# Altium schematic sheet HFPB_01, PAGE-1.SchDoc: Power Board (part 1 of 2)
size 420 x 297 mm; Date: Monday, September 07, 2020; DocumentNumber: HFPB_01; Revision: .01; SheetNumber: 1; SheetTotal: 2; PageSetup: Record=PageOptions|CenterHorizontal=True|CenterVertical=True|PrintScale=0.71|XCorrection=1.00|YCorrection=1.00|PrintKind=0|BorderSize=5000000|LeftOffset=0|BottomOffset=0|Orientation=2|PaperLength=1000|PaperWidth=1000|Scale=100|PaperSource=7|PrintQuality=-3|MediaType=1|DitherType=10|PaperKind=A4|PrintScaleMode=1; PageName: Controller and Supply
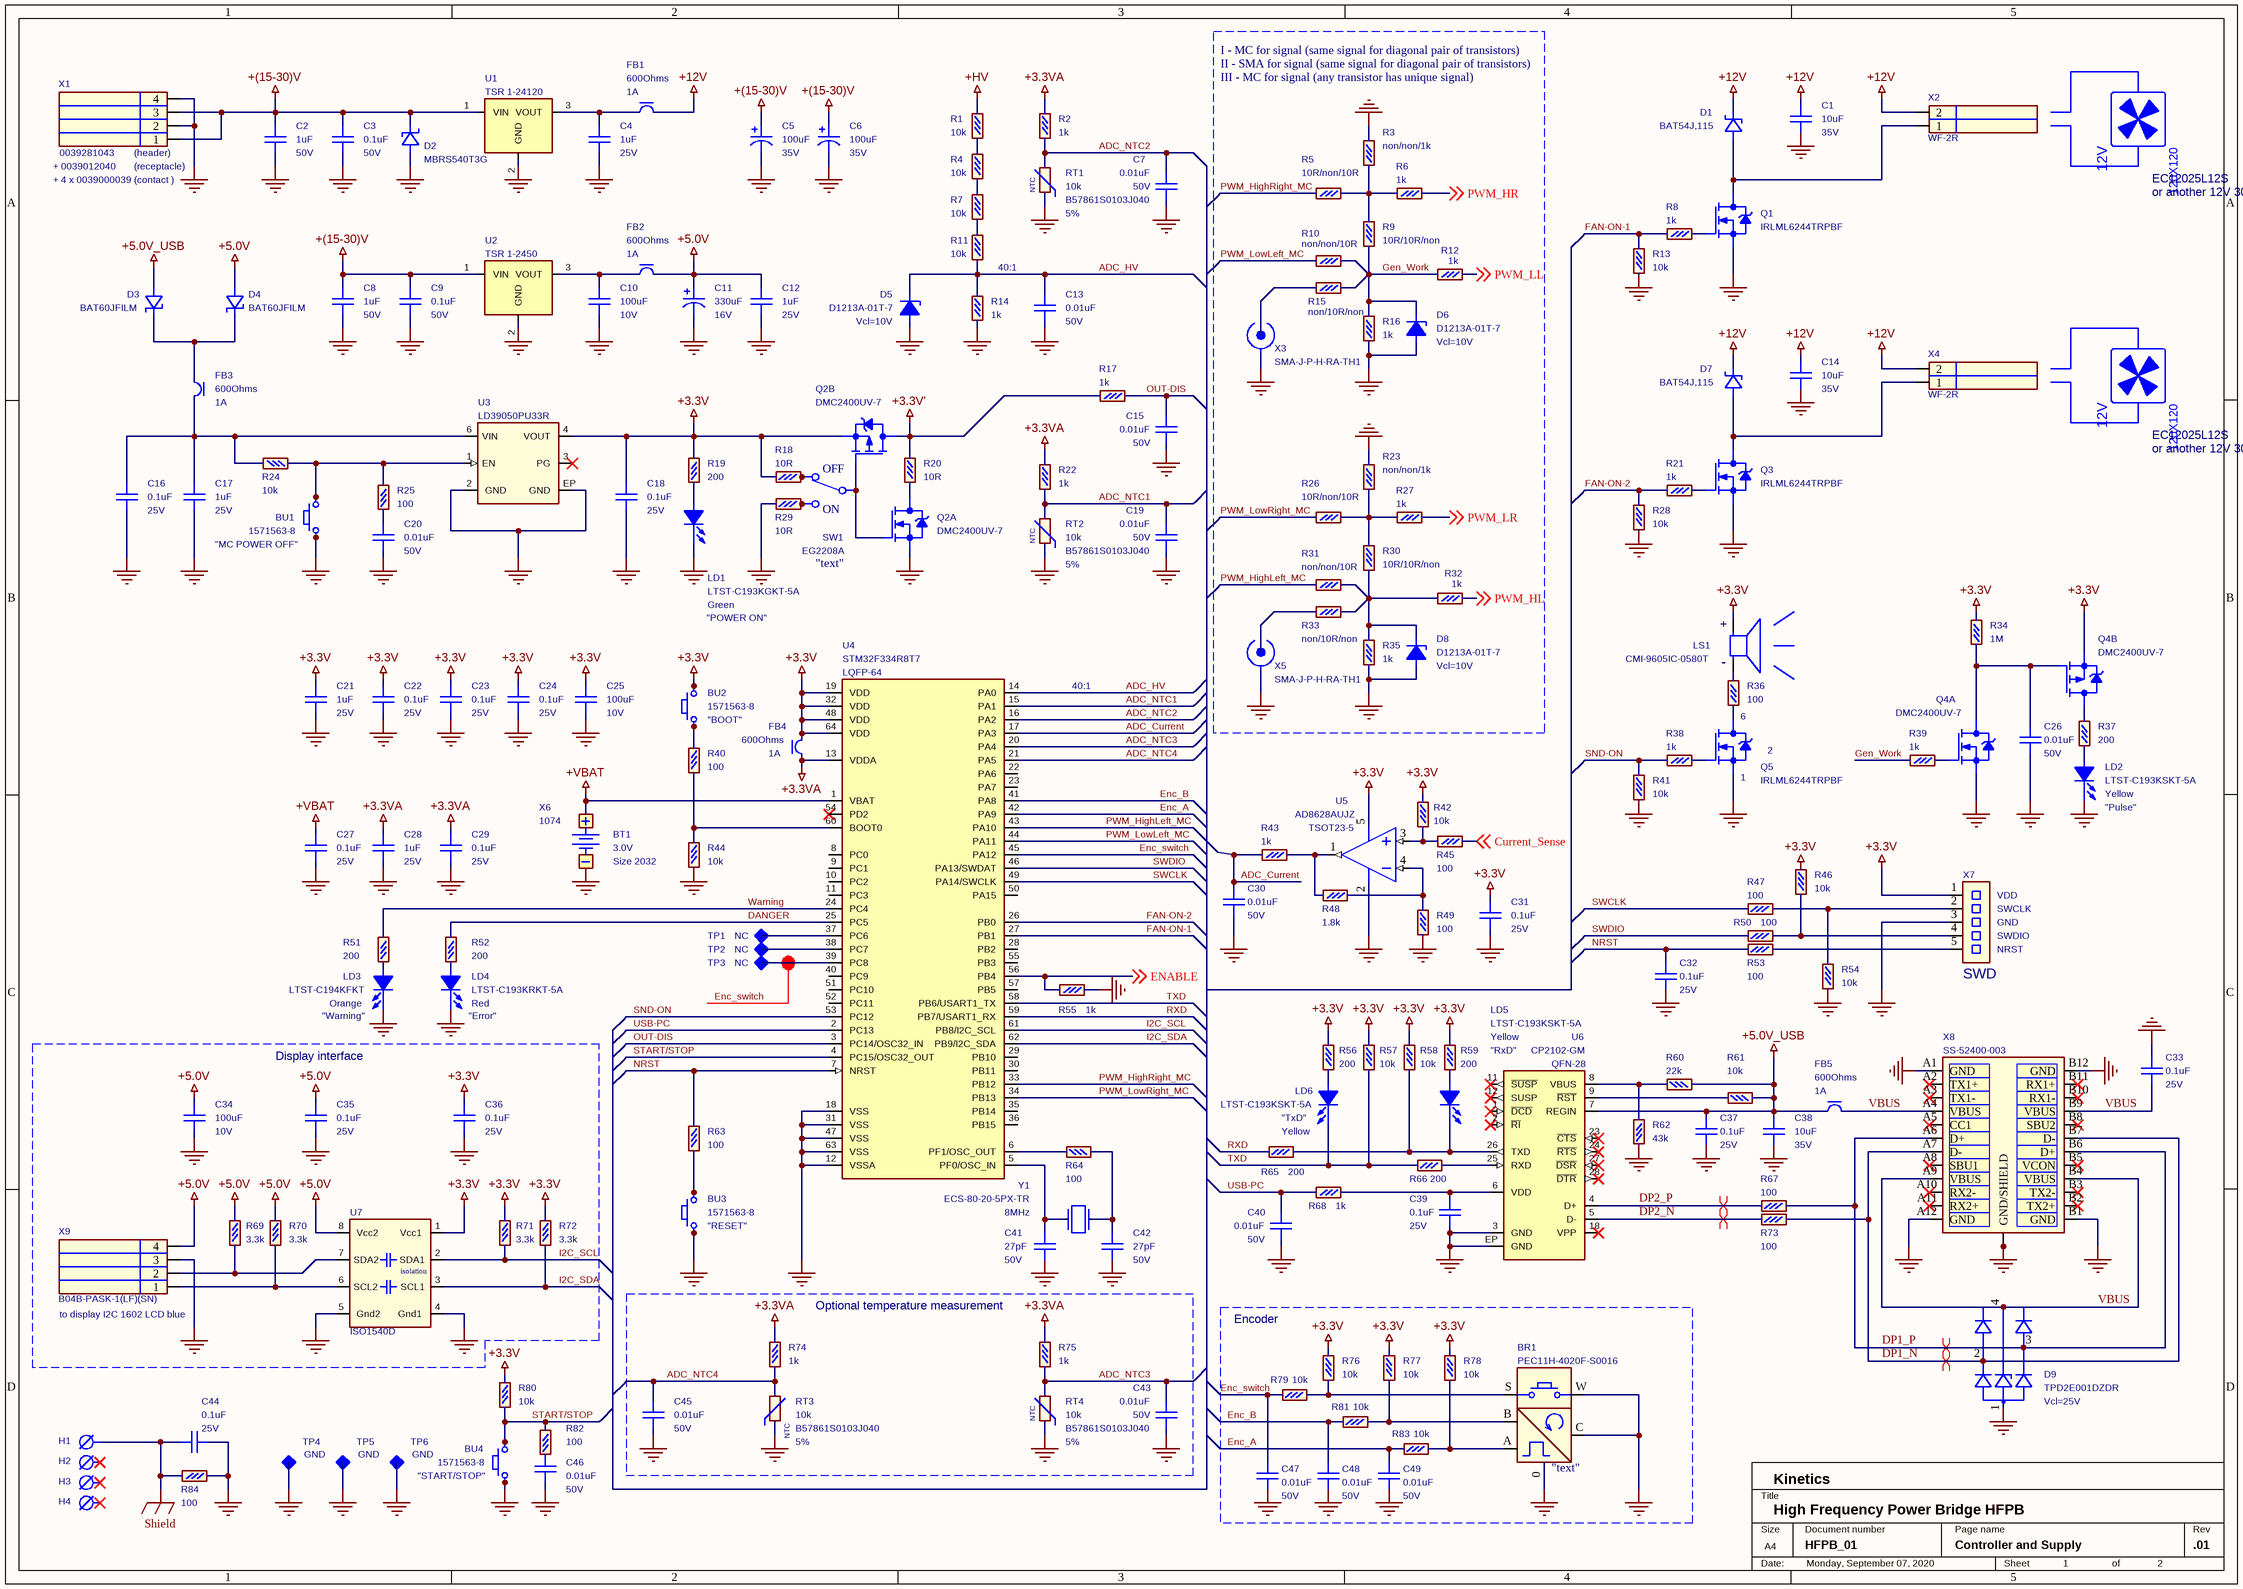
[diagram p0: HFPB_01, PAGE-1.SchDoc]

## Parts
BR1  PEC11H-4020F-S0016  value "text"  [BOURNS_PEC11H]
BT1  3.0V  (graphical)
BU1  1571563-8  value "MC POWER OFF"  [TE_1571563-8]
BU2  1571563-8  value "BOOT"  [TE_1571563-8]
BU3  1571563-8  value "RESET"  [TE_1571563-8]
BU4  1571563-8  value "START/STOP"  [TE_1571563-8]
C1  10uF  Value3: 35V  [CAPC320X250X280L60N - full legend]
C2  1uF  Value3: 50V  [CAPC160X80X80L35N - Full legend]
C3  0.1uF  Value3: 50V  [CAPC160X80X80L35N - Full legend]
C4  1uF  Value3: 25V  [CAPC160X80X80L35N - Full legend]
C5  100uF  Value3: 35V  [CAPPRD350W60D850H900]
C6  100uF  Value3: 35V  [CAPPRD350W60D850H900]
C7  0.01uF  Value3: 50V  [CAPC160X80X80L35N - Full legend]
C8  1uF  Value3: 50V  [CAPC160X80X80L35N - Full legend]
C9  0.1uF  Value3: 50V  [CAPC160X80X80L35N - Full legend]
C10  100uF  Value3: 10V  [CAPC320X250X280L60N - full legend]
C11  330uF  Value3: 16V  [CAPPRD350W60D850H900]
C12  1uF  Value3: 25V  [CAPC160X80X80L35N - Full legend]
C13  0.01uF  Value3: 50V  [CAPC160X80X80L35N - Full legend]
C14  10uF  Value3: 35V  [CAPC320X250X280L60N - full legend]
C15  0.01uF  Value3: 50V  [CAPC160X80X80L35N - Full legend]
C16  0.1uF  Value3: 25V  [CAPC160X80X80L35N - Full legend]
C17  1uF  Value3: 25V  [CAPC160X80X80L35N - Full legend]
C18  0.1uF  Value3: 25V  [CAPC160X80X80L35N - Full legend]
C19  0.01uF  Value3: 50V  [CAPC160X80X80L35N - Full legend]
C20  0.01uF  Value3: 50V  [CAPC160X80X80L35N - Full legend]
C21  1uF  Value3: 25V  [CAPC160X80X80L35N - Full legend]
C22  0.1uF  Value3: 25V  [CAPC160X80X80L35N - Full legend]
C23  0.1uF  Value3: 25V  [CAPC160X80X80L35N - Full legend]
C24  0.1uF  Value3: 25V  [CAPC160X80X80L35N - Full legend]
C25  100uF  Value3: 10V  [CAPC320X250X280L60N - full legend]
C26  0.01uF  Value3: 50V  [CAPC160X80X80L35N - Full legend]
C27  0.1uF  Value3: 25V  [CAPC160X80X80L35N - Full legend]
C28  1uF  Value3: 25V  [CAPC160X80X80L35N - Full legend]
C29  0.1uF  Value3: 25V  [CAPC160X80X80L35N - Full legend]
C30  0.01uF  Value3: 50V  [CAPC160X80X80L35N - Full legend]
C31  0.1uF  Value3: 25V  [CAPC160X80X80L35N - Full legend]
C32  0.1uF  Value3: 25V  [CAPC160X80X80L35N - Full legend]
C33  0.1uF  Value3: 25V  [CAPC160X80X80L35N - Full legend]
C34  100uF  Value3: 10V  [CAPC320X250X280L60N - full legend]
C35  0.1uF  Value3: 25V  [CAPC160X80X80L35N - Full legend]
C36  0.1uF  Value3: 25V  [CAPC160X80X80L35N - Full legend]
C37  0.1uF  Value3: 25V  [CAPC160X80X80L35N - Full legend]
C38  10uF  Value3: 35V  [CAPC320X250X280L60N - full legend]
C39  0.1uF  Value3: 25V  [CAPC160X80X80L35N - Full legend]
C40  0.01uF  Value3: 50V  [CAPC160X80X80L35N - Full legend]
C41  27pF  Value3: 50V  [CAPC160X80X80L35N - Full legend]
C42  27pF  Value3: 50V  [CAPC160X80X80L35N - Full legend]
C43  0.01uF  Value3: 50V  [CAPC160X80X80L35N - Full legend]
C44  0.1uF  Value3: 25V  [CAPC160X80X80L35N - Full legend]
C45  0.01uF  Value3: 50V  [CAPC160X80X80L35N - Full legend]
C46  0.01uF  Value3: 50V  [CAPC160X80X80L35N - Full legend]
C47  0.01uF  Value3: 50V  [CAPC160X80X80L35N - Full legend]
C48  0.01uF  Value3: 50V  [CAPC160X80X80L35N - Full legend]
C49  0.01uF  Value3: 50V  [CAPC160X80X80L35N - Full legend]
D1  BAT54J,115  [SODFL250X125X80L40X32N]
D2  MBRS540T3G  [DIOM795X585X240L100X300N]
D3  BAT60JFILM  [SOD250X125X110L30X32N]
D4  BAT60JFILM  [SOD250X125X110L30X32N]
D5  D1213A-01T-7  Value2: Vcl=10V  [SODFL160X80X65L30X30N]
D6  D1213A-01T-7  Value2: Vcl=10V  [SODFL160X80X65L30X30N]
D7  BAT54J,115  [SODFL250X125X80L40X32N]
D8  D1213A-01T-7  Value2: Vcl=10V  [SODFL160X80X65L30X30N]
D9  TPD2E001DZDR  Value2: Vcl=25V  [SOT143-4P192_237X122L40X40N]
FB1  600Ohms  Value1: 1A  [BEADC160X80X80L30N]
FB2  600Ohms  Value1: 1A  [BEADC160X80X80L30N]
FB3  600Ohms  Value1: 1A  [BEADC160X80X80L30N]
FB4  600Ohms  Value1: 1A  [BEADC160X80X80L30N]
FB5  600Ohms  Value1: 1A  [BEADC160X80X80L30N]
H1  (no value)  [hole/3.5/4.5-O]
H2  (no value)  [hole/3.5/4.5-O]
H3  (no value)  [hole/3.5/4.5-O]
H4  (no value)  [hole/3.5/4.5-O]
LD1  LTST-C193KGKT-5A  value Green  Text: "POWER ON"  [LEDC160X80X40L30N]
LD2  LTST-C193KSKT-5A  value Yellow  Text: "Pulse"  [LEDC160X80X40L30N]
LD3  LTST-C194KFKT  value Orange  Text: "Warning"  [LEDC160X80X40L30N]
LD4  LTST-C193KRKT-5A  value Red  Text: "Error"  [LEDC160X80X40L30N]
LD5  LTST-C193KSKT-5A  value Yellow  Text: "RxD"  [LEDC160X80X40L30N]
LD6  LTST-C193KSKT-5A  value Yellow  Text: "TxD"  [LEDC160X80X40L30N]
LS1  CMI-9605IC-0580T  [CUI_CMI-9605IC-0580T]
Q1  IRLML6244TRPBF  [SOT23-3P95_235X110L50X40N]
Q2  DMC2400UV-7  [TRXSOFL6P50_160X162X60L20X22N]  (parts A,B of 2)
Q3  IRLML6244TRPBF  [SOT23-3P95_235X110L50X40N]
Q4  DMC2400UV-7  [TRXSOFL6P50_160X162X60L20X22N]  (parts A,B of 2)
Q5  IRLML6244TRPBF  [SOT23-3P95_235X110L50X40N]
R1  10k  [RESC160X80X55L30N - Full legend]
R2  1k  [RESC160X80X55L30N - Full legend]
R3  non/non/1k  [RESC160X80X55L30N - Full legend]
R4  10k  [RESC160X80X55L30N - Full legend]
R5  10R/non/10R  [RESC160X80X55L30N - Full legend]
R6  1k  [RESC160X80X55L30N - Full legend]
R7  10k  [RESC160X80X55L30N - Full legend]
R8  1k  [RESC160X80X55L30N - Full legend]
R9  10R/10R/non  [RESC160X80X55L30N - Full legend]
R10  non/non/10R  [RESC160X80X55L30N - Full legend]
R11  10k  [RESC160X80X55L30N - Full legend]
R12  1k  [RESC160X80X55L30N - Full legend]
R13  10k  [RESC160X80X55L30N - Full legend]
R14  1k  [RESC160X80X55L30N - Full legend]
R15  non/10R/non  [RESC160X80X55L30N - Full legend]
R16  1k  [RESC160X80X55L30N - Full legend]
R17  1k  [RESC160X80X55L30N - Full legend]
R18  10R  [RESC160X80X55L30N - Full legend]
R19  200  [RESC160X80X55L30N - Full legend]
R20  10R  [RESC160X80X55L30N - Full legend]
R21  1k  [RESC160X80X55L30N - Full legend]
R22  1k  [RESC160X80X55L30N - Full legend]
R23  non/non/1k  [RESC160X80X55L30N - Full legend]
R24  10k  [RESC160X80X55L30N - Full legend]
R25  100  [RESC160X80X55L30N - Full legend]
R26  10R/non/10R  [RESC160X80X55L30N - Full legend]
R27  1k  [RESC160X80X55L30N - Full legend]
R28  10k  [RESC160X80X55L30N - Full legend]
R29  10R  [RESC160X80X55L30N - Full legend]
R30  10R/10R/non  [RESC160X80X55L30N - Full legend]
R31  non/non/10R  [RESC160X80X55L30N - Full legend]
R32  1k  [RESC160X80X55L30N - Full legend]
R33  non/10R/non  [RESC160X80X55L30N - Full legend]
R34  1M  [RESC160X80X55L30N - Full legend]
R35  1k  [RESC160X80X55L30N - Full legend]
R36  100  [RESC160X80X55L30N - Full legend]
R37  200  [RESC160X80X55L30N - Full legend]
R38  1k  [RESC160X80X55L30N - Full legend]
R39  1k  [RESC160X80X55L30N - Full legend]
R40  100  [RESC160X80X55L30N - Full legend]
R41  10k  [RESC160X80X55L30N - Full legend]
R42  10k  [RESC160X80X55L30N - Full legend]
R43  1k  [RESC160X80X55L30N - Full legend]
R44  10k  [RESC160X80X55L30N - Full legend]
R45  100  [RESC160X80X55L30N - Full legend]
R46  10k  [RESC160X80X55L30N - Full legend]
R47  100  [RESC160X80X55L30N - Full legend]
R48  1.8k  [RESC160X80X55L30N - Full legend]
R49  100  [RESC160X80X55L30N - Full legend]
R50  100  [RESC160X80X55L30N - Full legend]
R51  200  [RESC160X80X55L30N - Full legend]
R52  200  [RESC160X80X55L30N - Full legend]
R53  100  [RESC160X80X55L30N - Full legend]
R54  10k  [RESC160X80X55L30N - Full legend]
R55  1k  [RESC160X80X55L30N - Full legend]
R56  200  [RESC160X80X55L30N - Full legend]
R57  10k  [RESC160X80X55L30N - Full legend]
R58  10k  [RESC160X80X55L30N - Full legend]
R59  200  [RESC160X80X55L30N - Full legend]
R60  22k  [RESC160X80X55L30N - Full legend]
R61  10k  [RESC160X80X55L30N - Full legend]
R62  43k  [RESC160X80X55L30N - Full legend]
R63  100  [RESC160X80X55L30N - Full legend]
R64  100  [RESC160X80X55L30N - Full legend]
R65  200  [RESC160X80X55L30N - Full legend]
R66  200  [RESC160X80X55L30N - Full legend]
R67  100  [RESC160X80X55L30N - Full legend]
R68  1k  [RESC160X80X55L30N - Full legend]
R69  3.3k  [RESC160X80X55L30N - Full legend]
R70  3.3k  [RESC160X80X55L30N - Full legend]
R71  3.3k  [RESC160X80X55L30N - Full legend]
R72  3.3k  [RESC160X80X55L30N - Full legend]
R73  100  [RESC160X80X55L30N - Full legend]
R74  1k  [RESC160X80X55L30N - Full legend]
R75  1k  [RESC160X80X55L30N - Full legend]
R76  10k  [RESC160X80X55L30N - Full legend]
R77  10k  [RESC160X80X55L30N - Full legend]
R78  10k  [RESC160X80X55L30N - Full legend]
R79  10k  [RESC160X80X55L30N - Full legend]
R80  10k  [RESC160X80X55L30N - Full legend]
R81  10k  [RESC160X80X55L30N - Full legend]
R82  100  [RESC160X80X55L30N - Full legend]
R83  10k  [RESC160X80X55L30N - Full legend]
R84  100  [RESC160X80X55L30N - Full legend]
RT1  10k  Value1: 5%  [NTC - Through hole]
RT2  10k  Value1: 5%  [NTC - Through hole]
RT3  10k  Value1: 5%  [NTC - Through hole]
RT4  10k  Value1: 5%  [NTC - Through hole]
SW1  EG2208A  value "text"  [SK22D07]
TP1  NC  [hole/0.8/1.4-R]
TP2  NC  [hole/0.8/1.4-R]
TP3  NC  [hole/0.8/1.4-R]
TP4  GND  [hole/0.8/1.4-R]
TP5  GND  [hole/0.8/1.4-R]
TP6  GND  [hole/0.8/1.4-R]
U1  TSR 1-24120  [SIP800W50P254L1220H1010Q3]
U2  TSR 1-2450  [SIP800W50P254L1220H1010Q3]
U3  LD39050PU33R  [SON7P95_300X300X100L40X35T235X165N]
U4  STM32F334R8T7  Package/Case: LQFP-64  [QFP64P50_1200X1200X160L60X22N]
U5  AD8628AUJZ  Package/Case: TSOT23-5  [SOT23-5P95_280X145L45X40N]
U6  CP2102-GM  Package/Case: QFN-28  [QFN29P50_500X500X100L55X23T315N]
U7  ISO1540D  [SOIC-8]
X1  0039281043  [Molex_0039281043]
X2  WF-2R  [WF-02MR]
X3  SMA-J-P-H-RA-TH1  [Samtec_SMA-J-P-H-RA-TH1]
X4  WF-2R  [WF-02MR]
X5  SMA-J-P-H-RA-TH1  [Samtec_SMA-J-P-H-RA-TH1]
X6  1074  [Keystone-1074]
X7  SWD  [PLS-5]
X8  SS-52400-003  [BELFUSE_SS-52400-003]
X9  B04B-PASK-1(LF)(SN)  [JST_B04B-PASK-1]
Y1  8MHz  [XTAL1140X470X430D1310L435X63N]

## Blocks framed on the sheet
III - MC for signal (any transistor has unique signal): D6 D8 R3 R5 R6 R9 R10 R12 R15 R16 R23 R26 R27 R30-R33 R35 X3 X5
Display interface: C34-C36 R69-R72 U7 X9
Optional temperature measurement: C43 C45 R74 R75 RT3 RT4
Encoder: BR1 C47-C49 R76-R79 R81 R83

## Nets
+3.3V: BU2.3 BU2.4 C18.1 C21.1 C22.1 C23.1 C24.1 C25.1 C31.1 C36.1 FB4.1 LS1.P Q2.4(S2) Q4.4(S2) R18.2 R19.1 R34.1 R42.2 R46.2 R56.2 R57.2 R58.2 R59.2 R71.2 R72.2 R76.2 R77.2 R78.2 R80.2 U3.4(VOUT) U4.19(VDD) U4.32(VDD) U4.48(VDD) U4.64(VDD) U5.5(V+) U7.1(Vcc1) X7.1
+3.3V': Q2.3(D2) R17.1 R20.2
+3.3VA: C28.1 C29.1 FB4.2 R2.2 R22.2 R74.2 R75.2 U4.13(VDDA)
+5.0V: C11.P C12.1 C34.1 C35.1 D4.A FB2.1 R69.2 R70.2 U7.8(Vcc2) X9.4
+5.0V_USB: C37.2 C38.1 D3.A FB5.2 R60.1 R61.1 U6.7(REGIN)
+12V: C1.1 C14.1 D1.C D7.C FB1.1 X2.2 X4.2
+(15-30)V: C2.1 C3.1 C5.P C6.P C8.1 C9.1 D2.C U1.1(VIN) U2.1(VIN) X1.1 X1.3
+HV: R1.2
+VBAT: C27.1 U4.1(VBAT) X6.2(PLUS)
GND: BR1.0(SHIELD) BR1.C BR1.W BU1.1 BU1.2 BU3.1 BU3.2 BU4.1 BU4.2 C1.2 C2.2 C3.2 C4.2 C5.N C6.N C7.2 C8.2 C9.2 C10.2 C11.N C12.2 C13.2 C14.2 C15.2 C16.2 C17.2 C18.2 C19.2 C20.2 C21.2 C22.2 C23.2 C24.2 C25.2 C26.2 C27.2 C28.2 C29.2 C30.2 C31.2 C32.1 C33.2 C34.2 C35.2 C36.2 C37.1 C38.2 C39.1 C40.2 C41.2 C42.2 C43.2 C44.2 C45.2 C46.2 C47.2 C48.2 C49.2 D2.A D5.A(Anode) D6.A(Anode) D8.A(Anode) D9.1(GND) LD1.C LD2.C LD3.C LD4.C Q1.2(S) Q2.1(S1) Q3.2(S) Q4.1(S1) Q5.2(S) R3.1 R13.1 R14.1 R16.2 R23.1 R28.1 R29.2 R35.2 R41.1 R44.1 R49.1 R54.1 R55.2 R62.2 R84.2 RT1.1 RT2.1 RT3.1 RT4.1 TP4.1 TP5.1 TP6.1 U1.2(GND) U2.2(GND) U3.2(GND) U3.EP(GND) U4.12(VSSA) U4.18(VSS) U4.31(VSS) U4.47(VSS) U4.63(VSS) U5.2(V-) U6.3(GND) U6.EP(GND) U7.4(Gnd1) U7.5(Gnd2) X1.2 X1.4 X3.2 X5.2 X6.1(MINUS) X7.3 X8.A1(GND) X8.A12(GND) X8.B1(GND) X8.B12(GND) X8.G1(GND/SHIELD) X8.G2(GND/SHIELD) X8.G3(GND/SHIELD) X8.G4(GND/SHIELD) X8.S1(GND/SHIELD) X8.S2(GND/SHIELD) X8.S3(GND/SHIELD) X8.S4(GND/SHIELD) X9.3
Shield: C44.1 H1.1 R84.1
ADC_Current: C30.1 R43.1 U4.17(PA3)
ADC_HV: C13.1 D5.C(Cathode) R11.1 R14.2 U4.14(PA0)
ADC_NTC1: C19.1 R22.1 RT2.2 U4.15(PA1)
ADC_NTC2: C7.1 R2.1 RT1.2 U4.16(PA2)
ADC_NTC3: C43.1 R75.1 RT4.2 U4.20(PA4)
ADC_NTC4: C45.1 R74.1 RT3.2 U4.21(PA5)
Current_Sense: R45.2 ; off-sheet Current_Sense
DANGER: R52.1 U4.25(PC5)
DP1_N: D9.2(IO1) R73.1 X8.A7(D-) X8.B7(D-)
DP1_P: D9.3(IO2) R67.1 X8.A6(D+) X8.B6(D+)
DP2_N: R73.2 U6.5(D-)
DP2_P: R67.2 U6.4(D+)
ENABLE: R55.1 U4.56(PB4) ; off-sheet ENABLE
Enc_A: C49.1 R83.2 U4.42(PA9)
Enc_B: C48.1 R81.2 U4.41(PA8)
Enc_switch: C47.1 R79.2 U4.45(PA12)
FAN-ON-1: R8.1 R13.2 U4.27(PB1)
FAN-ON-2: R21.1 R28.2 U4.26(PB0)
Gen_Work: D6.C(Cathode) R9.1 R10.2 R12.1 R15.2 R16.1 R39.1
I2C_SCL: R71.1 U4.61(PB8/I2C_SCL) U7.2(SDA1)
I2C_SDA: R72.1 U4.62(PB9/I2C_SDA) U7.3(SCL1)
NRST: C32.2 R53.2 R63.2 U4.7(NRST)
OUT-DIS: C15.1 R17.2 U4.3(PC14/OSC32_IN)
PWM_HighLeft_MC: R31.1 U4.43(PA10)
PWM_HighRight_MC: R5.1 U4.33(PB12)
PWM_HL: R32.2 ; off-sheet PWM_HL
PWM_HR: R6.2 ; off-sheet PWM_HR
PWM_LL: R12.2 ; off-sheet PWM_LL
PWM_LowLeft_MC: R10.1 U4.44(PA11)
PWM_LowRight_MC: R26.1 U4.34(PB13)
PWM_LR: R27.2 ; off-sheet PWM_LR
RXD: R65.2 U4.59(PB7/USART1_RX)
SND-ON: R38.1 R41.2 U4.53(PC12)
START/STOP: BU4.3 BU4.4 R80.1 R82.1 U4.4(PC15/OSC32_OUT)
SWCLK: R47.2 U4.49(PA14/SWCLK)
SWDIO: R50.2 U4.46(PA13/SWDAT)
TXD: LD6.C R57.1 R66.2 U4.58(PB6/USART1_TX)
USB-PC: C40.1 R68.1 U4.2(PC13)
VBUS: C33.1 D9.4(VCC) FB5.1 X8.A4(VBUS) X8.A9(VBUS) X8.B4(VBUS) X8.B9(VBUS)
Warning: R51.1 U4.24(PC4)
NetBR1_A: BR1.A R78.1 R83.1
NetBR1_B: BR1.B R77.1 R81.1
NetBR1_S: BR1.S R76.1 R79.1
NetBU1_3: BU1.3 BU1.4 R24.2 R25.1 U3.1(EN)
NetBU2_1: BU2.1 BU2.2 R40.2
NetBU3_3: BU3.3 BU3.4 R63.1
NetC4_1: C4.1 FB1.2 U1.3(VOUT)
NetC10_1: C10.1 FB2.2 U2.3(VOUT)
NetC16_1: C16.1 C17.1 FB3.1 R24.1 U3.6(VIN)
NetC20_1: C20.1 R25.2
NetC26_1: C26.1 Q4.5(G2) Q4.6(D1) R34.2
NetC39_2: C39.2 R68.2 U6.6(VDD)
NetC41_1: C41.1 U4.5(PF0/OSC_IN) Y1.1
NetC42_1: C42.1 R64.1 Y1.2
NetC46_1: C46.1 R82.2
NetD1_A: D1.A Q1.3(D) X2.1
NetD3_C: D3.C D4.C FB3.2
NetD7_A: D7.A Q3.3(D) X4.1
NetD8_C: D8.C(Cathode) R30.1 R31.2 R32.1 R33.2 R35.1
NetLD1_A: LD1.A R19.2
NetLD2_A: LD2.A R37.2
NetLD3_A: LD3.A R51.2
NetLD4_A: LD4.A R52.2
NetLD5_A: LD5.A R59.1
NetLD5_C: LD5.C R58.1 R65.1 U6.26(TXD)
NetLD6_A: LD6.A R56.1
NetLS1_N: LS1.N R36.1
NetQ1_1: Q1.1(G) R8.2
NetQ2_2: Q2.2(G1) Q2.5(G2) SW1.2 SW1.5
NetQ2_6: Q2.6(D1) R20.1
NetQ3_1: Q3.1(G) R21.2
NetQ4_2: Q4.2(G1) R39.2
NetQ4_3: Q4.3(D2) R37.1
NetQ5_1: Q5.1(G) R38.2
NetQ5_3: Q5.3(D) R36.2
NetR1_1: R1.1 R4.2
NetR3_2: R3.2 R5.2 R6.1 R9.2
NetR4_1: R4.1 R7.2
NetR7_1: R7.1 R11.2
NetR15_1: R15.1 X3.1
NetR18_1: R18.1 SW1.1 SW1.4
NetR23_2: R23.2 R26.2 R27.1 R30.2
NetR29_1: R29.1 SW1.3 SW1.6
NetR33_1: R33.1 X5.1
NetR40_1: R40.1 R44.2 U4.60(BOOT0)
NetR42_1: R42.1 R45.1 U5.3(IN+)
NetR43_2: R43.2 R48.1 U5.1(OUT)
NetR46_1: R46.1 R50.1 X7.4
NetR47_1: R47.1 R54.2 X7.2
NetR48_2: R48.2 R49.2 U5.4(IN-)
NetR53_1: R53.1 X7.5
NetR60_2: R60.2 R62.1 U6.8(VBUS)
NetR61_2: R61.2 U6.9(~{RST})
NetR64_2: R64.2 U4.6(PF1/OSC_OUT)
NetR66_1: R66.1 U6.25(RXD)
NetR69_1: R69.1 U7.7(SDA2) X9.2
NetR70_1: R70.1 U7.6(SCL2) X9.1
NetTP1_1: TP1.1 U4.37(PC6)
NetTP2_1: TP2.1 U4.38(PC7)
NetTP3_1: TP3.1 U4.39(PC8)

Not connected (* = marked no-connect by the designer): BT1 1 2; H2 1*; H3 1*; H4 1*; U3 3(PG)* 5(NC); U4 8(PC0) 9(PC1) 10(PC2) 11(PC3) 22(PA6) 23(PA7) 28(PB2) 29(PB10) 30(PB11) 35(PB14) 36(PB15) 40(PC9) 50(PA15) 51(PC10) 52(PC11) 54(PD2)* 55(PB3) 57(PB5); U6 1(~{DCD})* 2(~{RI})* 11(~{SUSP})* 12(SUSP)* 18(VPP)* 23(~{CTS})* 24(~{RTS})* 27(~{DSR})* 28(~{DTR})*; X8 A2(TX1+)* A3(TX1-)* A5(CC1)* A8(SBU1)* A10(RX2-)* A11(RX2+)* B2(TX2+)* B3(TX2-)* B5(VCON)* B8(SBU2)* B10(RX1-)* B11(RX1+)*

## Layout directives
differential pair: DP1_N, DP1_P, DP2_N, DP2_P

## Notes on the sheet
- I - MC for signal (same signal for diagonal pair of transistors)
- II - SMA for signal (same signal for diagonal pair of transistors)
- + 0039012040
- (near X1) + 4 x 0039000039
- (near X1) (header)
- (near X1) (receptacle)
- (near X1) (contact )
- 12V
- EC12025L12S
- 120X120
- or another 12V 300mA (or less)
- 40:1
- (near SW1) ON
- OFF
- 6
- (near Q5) 1
- 2
- Size 2032
- (near X7) SWCLK
- (near X7) GND
- (near X7) SWDIO
- (near X7) VDD
- (near X7) NRST
- (near X9) to display I2C 1602 LCD blue
- Kinetics
- High Frequency Power Bridge HFPB
- Labels drawn without touching a wire or pin: Enc_switch
- Size
- Title
- Document number
- Page name
- Rev
- Date:
- A4
- Sheet
- of
- (in symbol B57861S0103J040) NTC
- (in symbol CMI-9605IC-0580T) +; -
- (in symbol ISO1540D) isolation